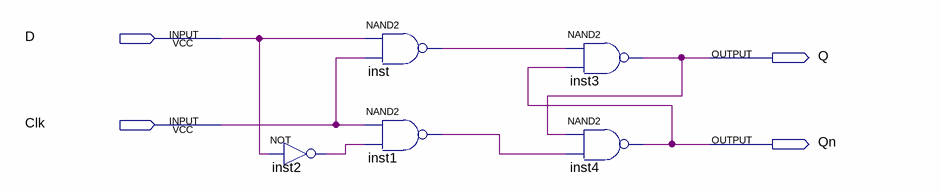
[diagram p0: schematic sheet]
// Quartus schematic lab9step2.bdf as structural Verilog: 5 symbols, 4 pins
module lab9step2 (
  input  D,
  input  Clk,
  output Q,
  output Qn
);

  wire inst1_out, inst2_out, inst_out;

  not inst2 (inst2_out, D);
  nand inst (inst_out, D, Clk);
  nand inst1 (inst1_out, Clk, inst2_out);
  nand inst3 (Q, inst_out, Qn);
  nand inst4 (Qn, Q, inst1_out);
endmodule
